# EAGLE design OSIVE Slim DUE-Shield (EAGLE 9.0.1)
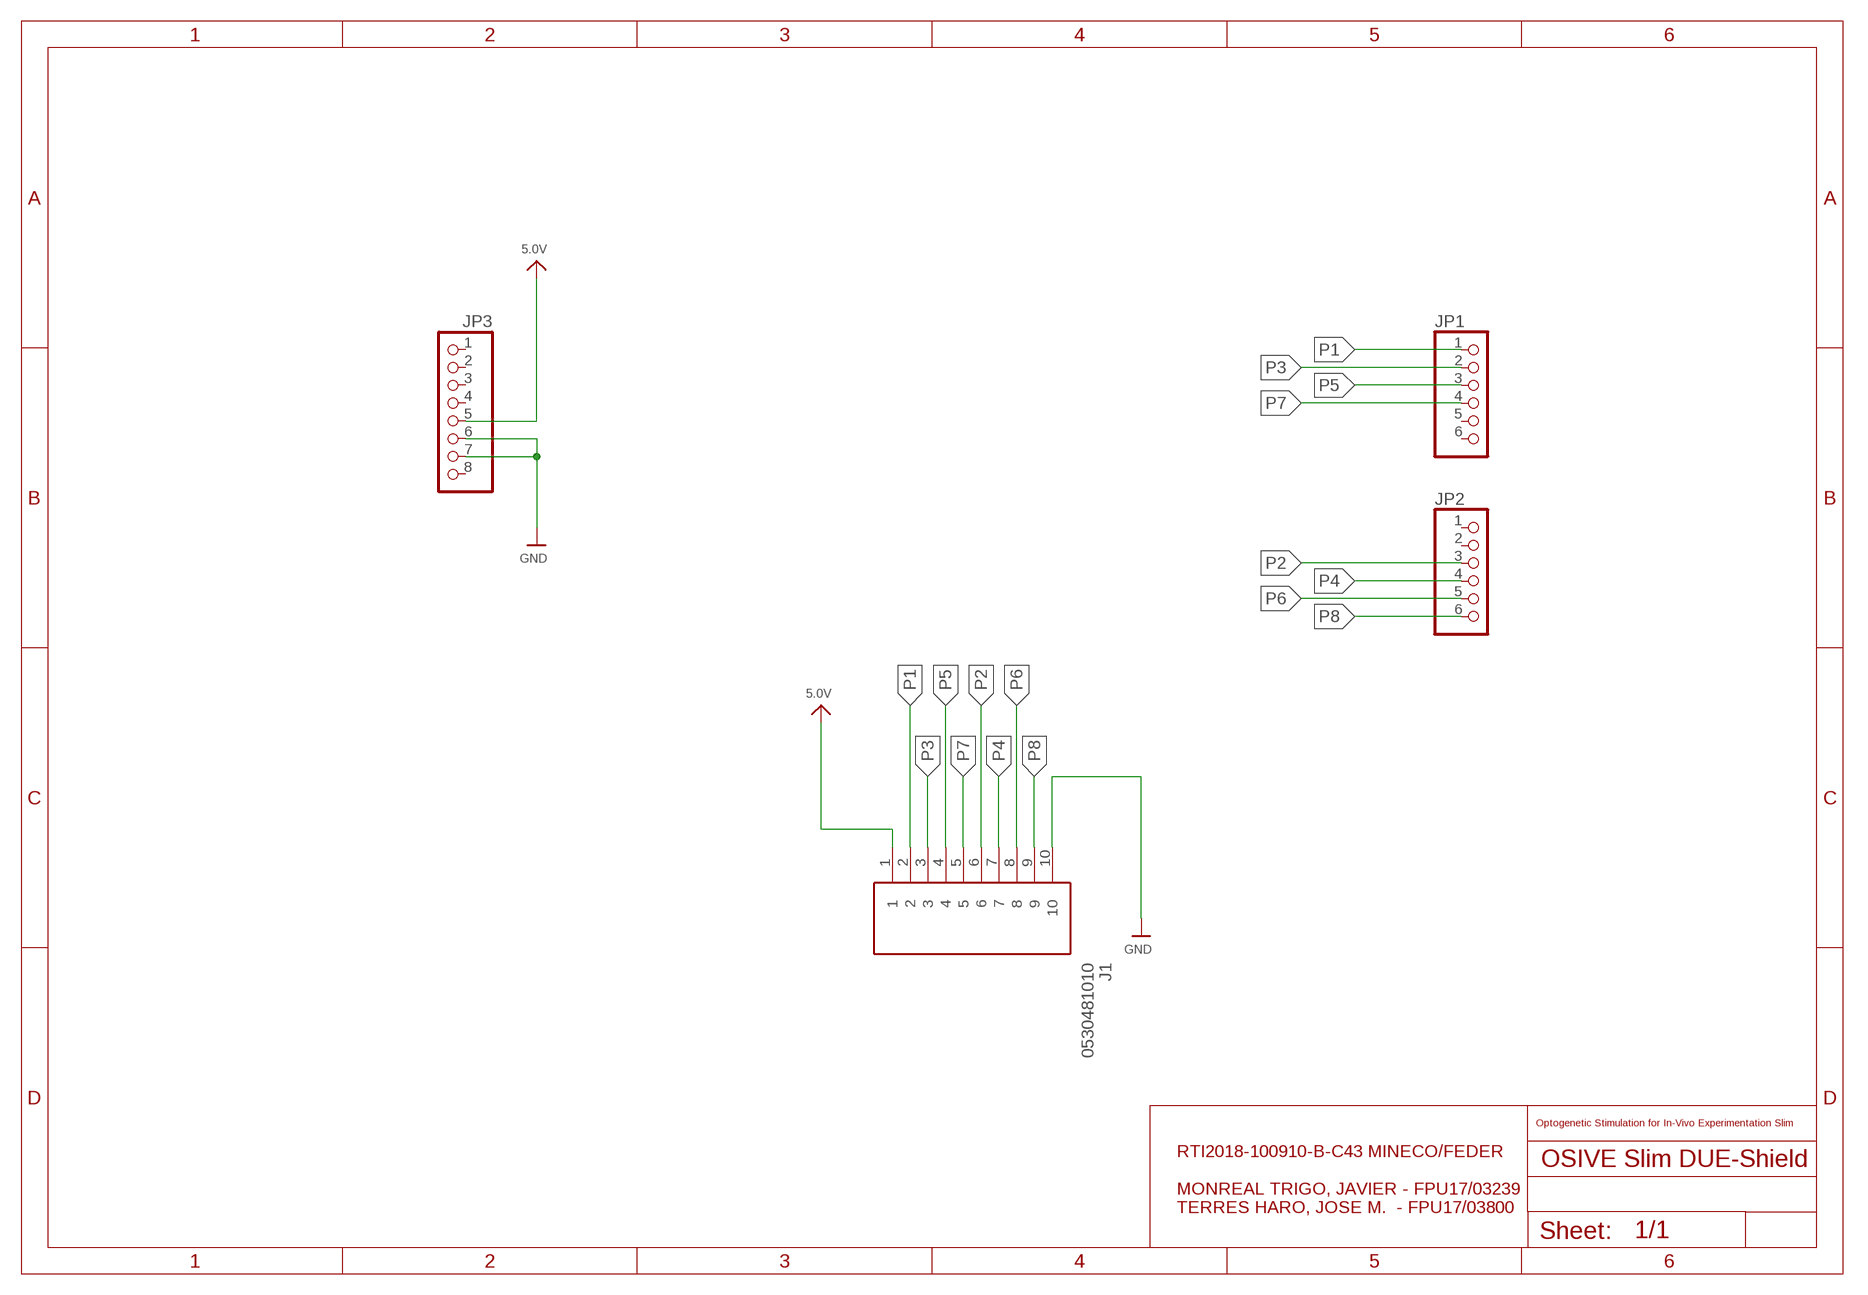
[diagram p0: schematic, sheet 1]

## Parts
J1  0530481010  [0530481010]
JP1  HEADER-1X6  [1X06_OVAL]
JP2  HEADER-1X6  [1X06_OVAL]
JP3  HEADER-1X8  [1X08_OVAL]

## Nets
5.0V: J1.1 JP3.5
GND: J1.10 JP3.6 JP3.7
P1: J1.2 JP1.1
P2: J1.6 JP2.3
P3: J1.3 JP1.2
P4: J1.7 JP2.4
P5: J1.4 JP1.3
P6: J1.8 JP2.5
P7: J1.5 JP1.4
P8: J1.9 JP2.6
Unconnected: JP1.5 JP1.6 JP2.1 JP2.2 JP3.1 JP3.2 JP3.3 JP3.4 JP3.8

## Notes on the sheet
- Optogenetic Stimulation for In-Vivo Experimentation Slim
- RTI2018-100910-B-C43 MINECO/FEDER
  
  MONREAL TRIGO, JAVIER - FPU17/03239
  TERRES HARO, JOSE M.  - FPU17/03800

## Library data of the parts
J1 = 0530481010:0530481010: Conn Shrouded Header (4 Sides) HDR 10 POS 1.25mm Solder RA Thru-Hole PicoBlade Tray Source: Datasheet <https://datasheet.datasheetarchive.com/originals/distributors/Datasheets-DGA22/2091711.pdf>; ARROW_PART_NUMBER: 0530481010; ARROW_PRICE-STOCK: https://www.arrow.com/en/products/0530481010/molex; DESCRIPTION: Conn Shrouded Header (4 Sides) HDR 10 POS 1.25mm Solder RA Thru-Hole PicoBlade Tray; HEIGHT: 3.7mm; MANUFACTURER_NAME: Molex; MANUFACTURER_PART_NUMBER: 0530481010
JP1 JP2 = microbuilder:HEADER-1X6: PIN HEADER
JP3 = microbuilder:HEADER-1X8: PIN HEADER

## Board
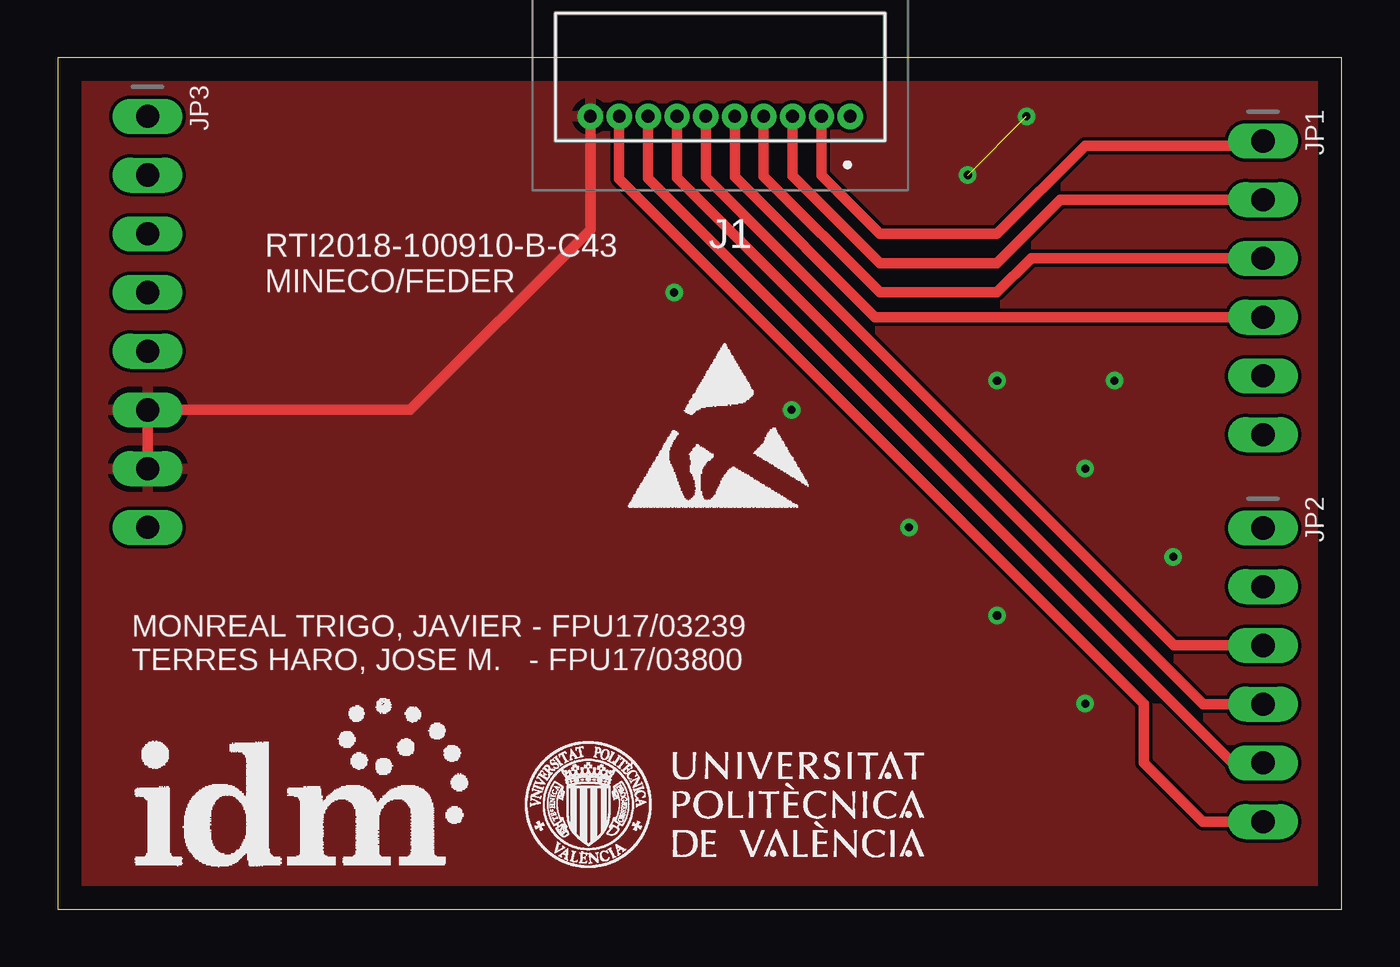
[diagram p1: board, top side]
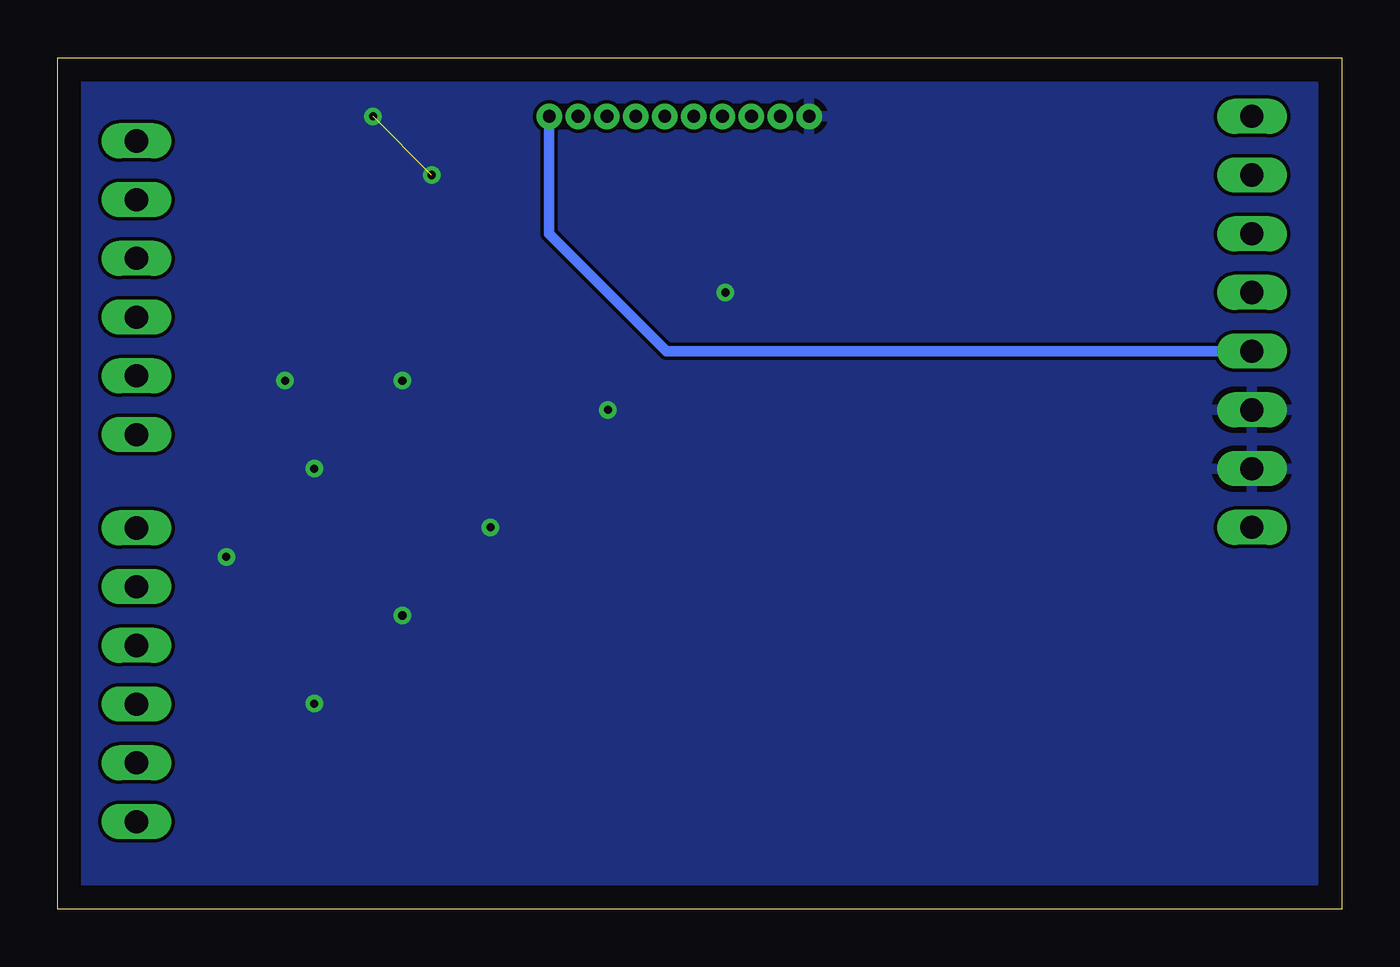
[diagram p2: board, bottom side, seen from below]

Size 55.55 x 36.82 mm. Coordinates in mm from the lower left corner, seen from the top.
Outline: 0,0 55.55,0 55.55,36.82 0,36.82 0,0
Copper layers (1*16): Top 0.035mm / dielectric 1.5mm / Bottom 0.035mm
Design rules "default": minimum track width 6mil, minimum drill 0.35mm, track to track 6mil, track to pad 6mil, pad to pad 6mil, via to via 6mil, smd to smd 6mil, copper to edge 40mil, drill to drill 6mil, minimum pad ring 10mil, minimum via ring 8mil, stop-mask expansion 4mil, vias tented up to drill 0mil, thermal gap 10mil

### Footprints (pad centres in the part's own frame; a part is rotated, then mirrored left to right if it is on the bottom)
0530481010 = drill 0.55 pad 1.1: 1 0,0; 2 -1.25,0; 3 -2.5,0; 4 -3.75,0; 5 -5,0; 6 -6.25,0; 7 -7.5,0; 8 -8.75,0; 9 -10,0; 10 -11.25,0
1X06_OVAL = drill 1 long: 1 -6.35,0; 2 -3.81,0; 3 -1.27,0; 4 1.27,0; 5 3.81,0; 6 6.35,0
1X08_OVAL = drill 1 long: 1 -8.89,0; 2 -6.35,0; 3 -3.81,0; 4 -1.27,0; 5 1.27,0; 6 3.81,0; 7 6.35,0; 8 8.89,0

### Placement (x,y rotation side)
J1  34.29,34.29 0 top
JP1  52.15,26.87 270 top
JP2  52.15,10.13 270 top
JP3  3.89,25.4 270 top

### Tracks (layer width: path | path; a pad name or v marks a point on that pad's centre or on a via)
5.0V
  Bottom 0.457: JP3.5 29.21,24.13 34.29,29.21 J1.1
GND  (via drill 0.35)  (1 unrouted)
  Top 0.457: JP3.7 JP3.6 15.24,21.59 23.04,29.39 J1.10
  other vias: 44.45,8.89 40.64,12.7 36.83,16.51 31.75,21.59 26.67,26.67 48.26,15.24 44.45,19.05 40.64,22.86 45.72,22.86 39.37,31.75 41.91,34.29
  pour Top: 0,36.83 55.88,36.83 55.88,0 0,0
  pour Bottom: 0,36.83 55.88,36.83 55.88,0 0,0
P1
  Top 0.457: JP1.1 51.94,33.02 44.45,33.02 40.64,29.21 35.56,29.21 33.04,31.73 J1.2
P2
  Top 0.457: J1.6 28.04,31.65 48.28,11.4 JP2.3
P3
  Top 0.457: JP1.2 43.38,30.68 40.64,27.94 35.56,27.94 34.29,29.21 31.79,31.71 J1.3
P4
  Top 0.457: JP2.4 49.55,8.87 26.79,31.63 J1.7
P5
  Top 0.457: J1.4 30.54,31.69 35.56,26.67 40.64,26.67 42.11,28.14 JP1.3
P6
  Top 0.457: J1.8 25.54,31.61 50.83,6.33 JP2.5
P7
  Top 0.457: JP1.4 35.36,25.6 29.29,31.67 J1.5
P8
  Top 0.457: JP2.6 49.53,3.79 46.99,6.33 46.99,8.89 24.29,31.59 J1.9

### Text on the board
tPlace: RTI2018-100910-B-C43 / MINECO/FEDER | MONREAL TRIGO, JAVIER - FPU17/03239 / TERRES HARO, JOSE M. - FPU17/03800